# Altium project mo_phong_may_bay.PrjPcb
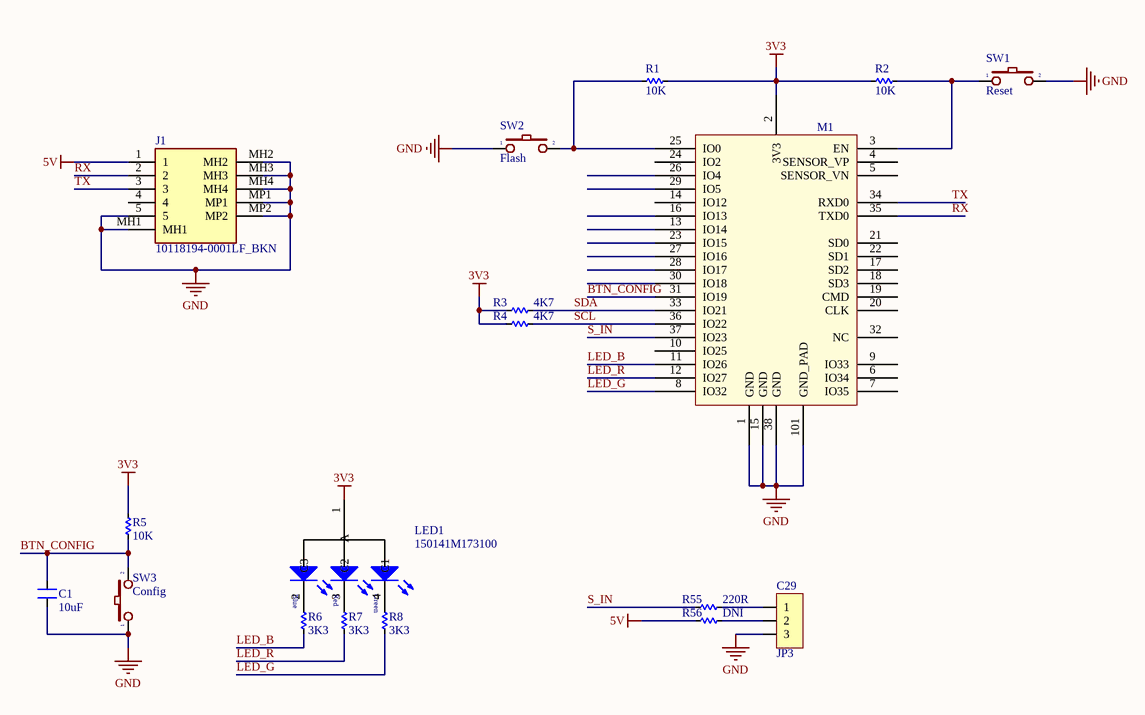
[diagram p0: [1]Esp32.SchDoc]
3 sheets, 98 parts. Net scope: global (net labels, ports and power ports of the same name join across sheets).
Board file: mo_phong_may_bay_pcb.PcbDoc
Sheets:
  [1]Esp32.SchDoc
  [2]Power.SchDoc
  [3]Motor.SchDoc

## Sheet [1]Esp32.SchDoc
size A4

### Parts
C1  10uF  [CN-SMD-0603]
C29  JP3  [JP3-D1C]
J1  10118194-0001LF_BKN  [101181940001LFBKN]
LED1  150141M173100  [LED RGB 3528]
M1  ESP32S_Module  [ESP32S]  (value not drawn)
R1  10K  [RES-SMD-0603]
R2  10K  [RES-SMD-0603]
R3  4K7  [RES-SMD-0603]
R4  4K7  [RES-SMD-0603]
R5  10K  [RES-SMD-0603]
R6  3K3  [RES-SMD-0603]
R7  3K3  [RES-SMD-0603]
R8  3K3  [RES-SMD-0603]
R55  220R  [RES-SMD-0603]
R56  DNI  [RES-SMD-0603]
SW1  Reset  [SW1-SMD]
SW2  Flash  [SW-DIP1-1]
SW3  Config  [SW1-SMD]

### Nets
3V3: LED1.1(A) M1.2(3V3) R1.1 R2.2 R3.1 R4.1 R5.2
5V: J1.1 R56.2
GND: C1.2 C29.3 J1.5 J1.MH1 J1.MH2 J1.MH3 J1.MH4 J1.MP1 J1.MP2 M1.1(GND) M1.15(GND) M1.38(GND) M1.101(GND_PAD) SW1.2 SW2.1 SW3.1
BTN_CONFIG: C1.1 M1.31(IO19) R5.1 SW3.2
LED_B: M1.11(IO26) R6.1
LED_G: M1.8(IO32) R8.1
LED_R: M1.12(IO27) R7.1
RX: J1.2 M1.35(TXD0)
S_IN: M1.37(IO23) R55.2
SCL: M1.36(IO22) R4.2
SDA: M1.33(IO21) R3.2
TX: J1.3 M1.34(RXD0)
NetC29_1: C29.1 R55.1
NetC29_2: C29.2 R56.1
NetLED1_2: LED1.2(C3) R6.2
NetLED1_3: LED1.3(C2) R7.2
NetLED1_4: LED1.4(C1) R8.2
NetM1_3: M1.3(EN) R2.1 SW1.1
NetM1_25: M1.25(IO0) R1.2 SW2.2

Not connected (* = marked no-connect by the designer): J1 4; M1 4(SENSOR_VP) 5(SENSOR_VN) 6(IO34) 7(IO35) 9(IO33) 10(IO25) 13(IO14) 14(IO12) 16(IO13) 17(SD2) 18(SD3) 19(CMD) 20(CLK) 21(SD0) 22(SD1) 23(IO15) 24(IO2) 26(IO4) 27(IO16) 28(IO17) 29(IO5) 30(IO18) 32(NC)

### Notes on the sheet
- (in symbol LED RGB SMD) Blue; Red; Green

### Library data of the parts
C1 = CN: Tu gom; Value: 33pF
C29 = JP3: WR-PHD 2.54 mm Angled Socket Header; Manufacturer: W¨¹rth Elektronik eiSos GmbH; partNo: 613003143121; ComponentLink1 Description: Manufacturer; ComponentLink2 Description: Datasheet; NoPins: 03; Created Date: 29 March 2013; ComponentLink1URL: http://www.we-online.com; ComponentLink2URL: http://katalog.we-online.de/em/datasheet/6130xx143121.pdf; Created by: Karrer Zheng
J1 = 10118194-0001LF_BKN: Connector; Manufacturer_Name: Amphenol; Manufacturer_Part_Number: 10118194-0001LF/BKN; Datasheet Link: https://cdn.amphenol-cs.com/media/wysiwyg/files/drawing/10118194.pdf; Height: 2.78mm
LED1 = LED RGB SMD: SMD Full-Color Top LED, WL-SFTW, Red & Green & Blue; Manufacturer: Würth Elektronik eiSos GmbH; PartNo: 150141M173100; ComponentLink1Description: Manufacturer; ComponentLink1URL: http://www.we-online.de; Created by: Christin Otto; Created Date: June 2013; ComponentLink2Description: Datasheet; ComponentLink2URL: http://katalog.we-online.com/led/datasheet/150141M173100.pdf; Color: Red & Green & Blue
M1 = ESP32S_Module: Esp-32S; Datasheet: https://espressif.com/sites/default/files/documentation/esp_wroom_32_datasheet_en.pdf
R1-R8 R55 R56 = Res-SMD: Resistor; Manufacturer: Generic Components; Class: Passive; Published: 08/06/2000; Publisher: Altium Hobart Technology Centre
SW1-SW3 = SW2: Switch button 2 pin; Value: SW chip 2 pin

## Sheet [2]Power.SchDoc
size A3
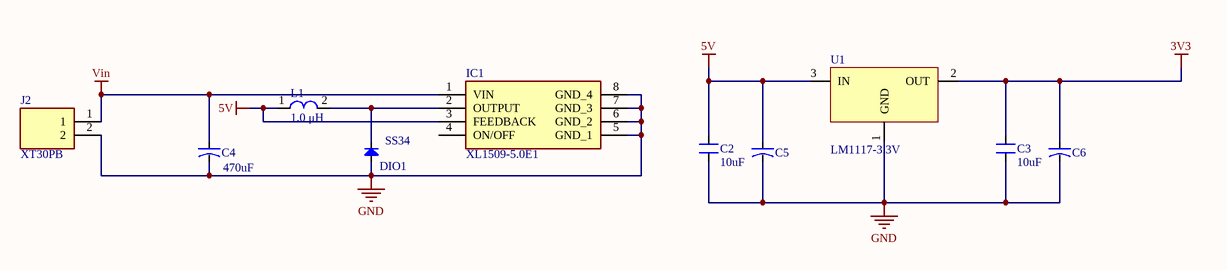
[diagram p1: [2]Power.SchDoc]

### Parts
C2  10uF  [CN-SMD-0603]
C3  10uF  [CN-SMD-0603]
C4  470uF  [CAP-ALU-SMD-6.3x7.7x2.2]
C5  CN-ALU-SMD  [CAP-ALU-SMD-4.5x5x1.4]  (value not drawn)
C6  CN-ALU-SMD  [CAP-ALU-SMD-4.5x5x1.4]  (value not drawn)
DIO1  SS34  [DIO-SMD-106]
IC1  XL1509-5.0E1  [SOIC127P600X175-8N]
J2  XT30PB  [XT30PB]
L1  1.0 μH  [L-SMD-M-7.3x4.5]
U1  LM1117-3.3V  [SOT223]

### Nets
3V3: C3.1 C6.1 U1.2(OUT)
5V: C2.1 C5.1 IC1.3(FEEDBACK) L1.1 U1.3(IN)
GND: C2.2 C3.2 C4.2 C5.2 C6.2 DIO1.1(A) IC1.5(GND_1) IC1.6(GND_2) IC1.7(GND_3) IC1.8(GND_4) J2.2 U1.1(GND)
Vin: C4.1 IC1.1(VIN) J2.1
NetDIO1_2: DIO1.2(K) IC1.2(OUTPUT) L1.2

Not connected (* = marked no-connect by the designer): IC1 4(ON/OFF)

### Library data of the parts
C2 C3 = CN: Tu gom; Value: 33pF
C4-C6 = CN-ALU-SMD: Polarized Capacitor (Axial); Published: 8-Jun-2000; LatestRevisionDate: 17-Jul-2002; LatestRevisionNote: Re-released for DXP Platform.; PackageReference: POLAR0.8; Publisher: Altium Limited
DIO1 = Diode SMD: Default Diode; Code - JEDEC: DO-214-AB; Value: 1N5007; Published: 8-Jun-2000; Revision: July-2002: Re-released for DXP Platform.; Publisher: Altium Limited
IC1 = XL1509-5.0E1: Integrated Circuit; Manufacturer_Name: XLSEMI; Datasheet Link: https://datasheet.lcsc.com/szlcsc/XLSEMI-XL1509-5-0E1_C61063.pdf; Height: 1.75mm; Manufacturer_Part_Number: XL1509-5.0E1
J2 = XT30PB: Connector; Manufacturer_Name: Amass; Datasheet Link: https://www.tme.eu/Document/4acc913878197f8c2e30d4b8cdc47230/XT30UPB%20SPEC.pdf; Height: 10.7mm; Manufacturer_Part_Number: XT30PB
L1 = L-SMD-1: partNo: 78477010; Manufacturer: Wurth Elektronik; Inductance: 1.0 μH; ComponentLink1Description: Manufacturer; ComponentLink1URL: http://www.we-online.de; Created by: Baojun Chen; Created Date: Nov.2015; ComponentLink2Description: Datasheet; ComponentLink2URL: http://katalog.we-online.de/pbs/datasheet/78477010.pdf
U1 = LM1117: 800mA Low-Dropout Linear Regulator; Creator: Nguyen Ba Bien; Website: http://group3i.net

## Sheet [3]Motor.SchDoc
size A3
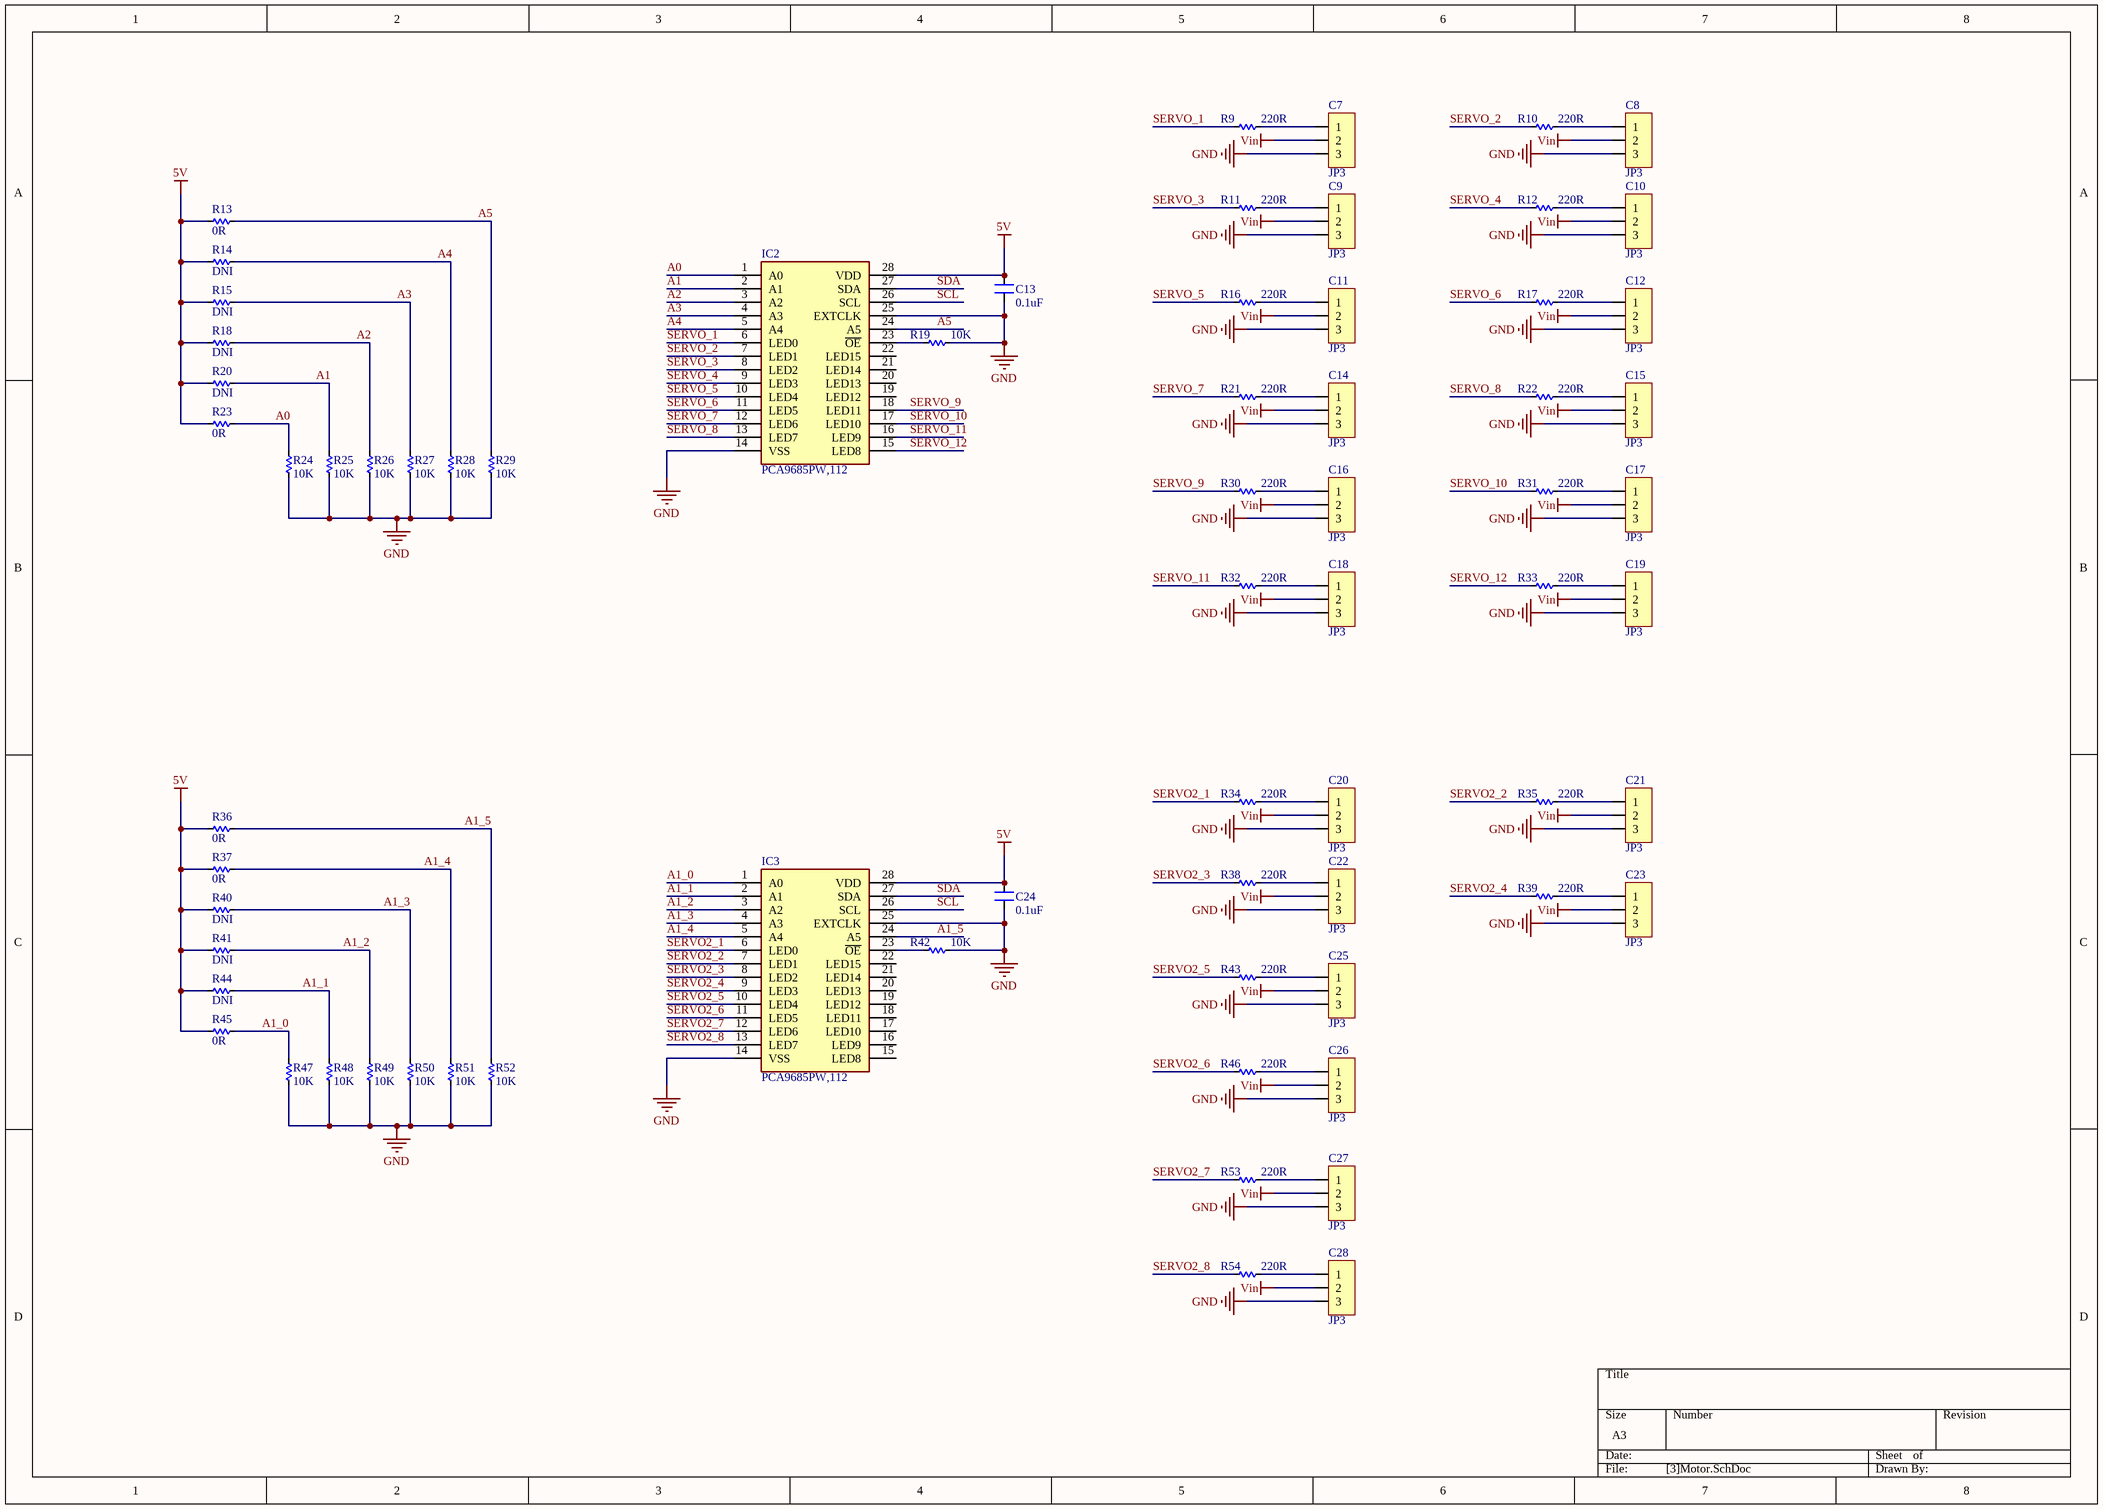
[diagram p2: [3]Motor.SchDoc]

### Parts
C7  JP3  [JP3-D1T]
C8  JP3  [JP3-D1T]
C9  JP3  [JP3-D1T]
C10  JP3  [JP3-D1T]
C11  JP3  [JP3-D1T]
C12  JP3  [JP3-D1T]
C13  0.1uF  [CN-SMD-0603]
C14  JP3  [JP3-D1T]
C15  JP3  [JP3-D1T]
C16  JP3  [JP3-D1T]
C17  JP3  [JP3-D1T]
C18  JP3  [JP3-D1T]
C19  JP3  [JP3-D1T]
C20  JP3  [JP3-D1T]
C21  JP3  [JP3-D1T]
C22  JP3  [JP3-D1T]
C23  JP3  [JP3-D1T]
C24  0.1uF  [CN-SMD-0603]
C25  JP3  [JP3-D1T]
C26  JP3  [JP3-D1T]
C27  JP3  [JP3-D1T]
C28  JP3  [JP3-D1T]
IC2  PCA9685PW,112  [SOP65P640X110-28N]
IC3  PCA9685PW,112  [SOP65P640X110-28N]
R9  220R  [RES-SMD-0603]
R10  220R  [RES-SMD-0603]
R11  220R  [RES-SMD-0603]
R12  220R  [RES-SMD-0603]
R13  0R  [RES-SMD-0603]
R14  DNI  [RES-SMD-0603]
R15  DNI  [RES-SMD-0603]
R16  220R  [RES-SMD-0603]
R17  220R  [RES-SMD-0603]
R18  DNI  [RES-SMD-0603]
R19  10K  [RES-SMD-0603]
R20  DNI  [RES-SMD-0603]
R21  220R  [RES-SMD-0603]
R22  220R  [RES-SMD-0603]
R23  0R  [RES-SMD-0603]
R24  10K  [RES-SMD-0603]
R25  10K  [RES-SMD-0603]
R26  10K  [RES-SMD-0603]
R27  10K  [RES-SMD-0603]
R28  10K  [RES-SMD-0603]
R29  10K  [RES-SMD-0603]
R30  220R  [RES-SMD-0603]
R31  220R  [RES-SMD-0603]
R32  220R  [RES-SMD-0603]
R33  220R  [RES-SMD-0603]
R34  220R  [RES-SMD-0603]
R35  220R  [RES-SMD-0603]
R36  0R  [RES-SMD-0603]
R37  0R  [RES-SMD-0603]
R38  220R  [RES-SMD-0603]
R39  220R  [RES-SMD-0603]
R40  DNI  [RES-SMD-0603]
R41  DNI  [RES-SMD-0603]
R42  10K  [RES-SMD-0603]
R43  220R  [RES-SMD-0603]
R44  DNI  [RES-SMD-0603]
R45  0R  [RES-SMD-0603]
R46  220R  [RES-SMD-0603]
R47  10K  [RES-SMD-0603]
R48  10K  [RES-SMD-0603]
R49  10K  [RES-SMD-0603]
R50  10K  [RES-SMD-0603]
R51  10K  [RES-SMD-0603]
R52  10K  [RES-SMD-0603]
R53  220R  [RES-SMD-0603]
R54  220R  [RES-SMD-0603]

### Nets
5V: C13.2 C24.2 IC2.28(VDD) IC3.28(VDD) R13.2 R14.2 R15.2 R18.2 R20.2 R23.2 R36.2 R37.2 R40.2 R41.2 R44.2 R45.2
GND: C7.3 C8.3 C9.3 C10.3 C11.3 C12.3 C13.1 C14.3 C15.3 C16.3 C17.3 C18.3 C19.3 C20.3 C21.3 C22.3 C23.3 C24.1 C25.3 C26.3 C27.3 C28.3 IC2.14(VSS) IC2.25(EXTCLK) IC3.14(VSS) IC3.25(EXTCLK) R19.2 R24.2 R25.2 R26.2 R27.2 R28.2 R29.2 R42.2 R47.2 R48.2 R49.2 R50.2 R51.2 R52.2
Vin: C7.2 C8.2 C9.2 C10.2 C11.2 C12.2 C14.2 C15.2 C16.2 C17.2 C18.2 C19.2 C20.2 C21.2 C22.2 C23.2 C25.2 C26.2 C27.2 C28.2
A0: IC2.1(A0) R23.1 R24.1
A1: IC2.2(A1) R20.1 R25.1
A1_0: IC3.1(A0) R45.1 R47.1
A1_1: IC3.2(A1) R44.1 R48.1
A1_2: IC3.3(A2) R41.1 R49.1
A1_3: IC3.4(A3) R40.1 R50.1
A1_4: IC3.5(A4) R37.1 R51.1
A1_5: IC3.24(A5) R36.1 R52.1
A2: IC2.3(A2) R18.1 R26.1
A3: IC2.4(A3) R15.1 R27.1
A4: IC2.5(A4) R14.1 R28.1
A5: IC2.24(A5) R13.1 R29.1
SCL: IC2.26(SCL) IC3.26(SCL)
SDA: IC2.27(SDA) IC3.27(SDA)
SERVO2_1: IC3.6(LED0) R34.1
SERVO2_2: IC3.7(LED1) R35.1
SERVO2_3: IC3.8(LED2) R38.1
SERVO2_4: IC3.9(LED3) R39.1
SERVO2_5: IC3.10(LED4) R43.1
SERVO2_6: IC3.11(LED5) R46.1
SERVO2_7: IC3.12(LED6) R53.1
SERVO2_8: IC3.13(LED7) R54.1
SERVO_1: IC2.6(LED0) R9.1
SERVO_2: IC2.7(LED1) R10.1
SERVO_3: IC2.8(LED2) R11.1
SERVO_4: IC2.9(LED3) R12.1
SERVO_5: IC2.10(LED4) R16.1
SERVO_6: IC2.11(LED5) R17.1
SERVO_7: IC2.12(LED6) R21.1
SERVO_8: IC2.13(LED7) R22.1
SERVO_9: IC2.18(LED11) R30.1
SERVO_10: IC2.17(LED10) R31.1
SERVO_11: IC2.16(LED9) R32.1
SERVO_12: IC2.15(LED8) R33.1
NetC7_1: C7.1 R9.2
NetC8_1: C8.1 R10.2
NetC9_1: C9.1 R11.2
NetC10_1: C10.1 R12.2
NetC11_1: C11.1 R16.2
NetC12_1: C12.1 R17.2
NetC14_1: C14.1 R21.2
NetC15_1: C15.1 R22.2
NetC16_1: C16.1 R30.2
NetC17_1: C17.1 R31.2
NetC18_1: C18.1 R32.2
NetC19_1: C19.1 R33.2
NetC20_1: C20.1 R34.2
NetC21_1: C21.1 R35.2
NetC22_1: C22.1 R38.2
NetC23_1: C23.1 R39.2
NetC25_1: C25.1 R43.2
NetC26_1: C26.1 R46.2
NetC27_1: C27.1 R53.2
NetC28_1: C28.1 R54.2
NetIC2_23: IC2.23(~{OE}) R19.1
NetIC3_23: IC3.23(~{OE}) R42.1

Not connected (* = marked no-connect by the designer): IC2 19(LED12) 20(LED13) 21(LED14) 22(LED15); IC3 15(LED8) 16(LED9) 17(LED10) 18(LED11) 19(LED12) 20(LED13) 21(LED14) 22(LED15)

### Library data of the parts
C7-C12 C14-C23 C25-C28 = JP3: as C29 on sheet [1]Esp32; Created Date: 29 March 2013; ComponentLink1URL: http://www.we-online.com; ComponentLink2URL: http://katalog.we-online.de/em/datasheet/6130xx143121.pdf; Created by: Karrer Zheng
C13 C24 = CN: Tu gom; Value: 33pF
IC2 IC3 = PCA9685PW,112: Integrated Circuit; Manufacturer_Name: NXP; Datasheet Link: http://www.nxp.com/docs/en/data-sheet/PCA9685.pdf; Height: 1.1mm; Manufacturer_Part_Number: PCA9685PW,112; Mouser Part Number: 771-PCA9685PW,112; Mouser Price/Stock: https://www.mouser.co.uk/ProductDetail/NXP-Semiconductors/PCA9685PW112?qs=6YAT8rHPFU9wZqiAeiOMZw%3D%3D; Arrow Part Number: PCA9685PW,112; Arrow Price/Stock: https://www.arrow.com/en/products/pca9685pw112/nxp-semiconductors?region=nac
R9-R54 = Res-SMD: as R1 on sheet [1]Esp32; Published: 08/06/2000; Publisher: Altium Hobart Technology Centre

## Nets that join several sheets
3V3: [1]Esp32 (7 pins), [2]Power (C3.1 C6.1 U1.2)
5V: [1]Esp32 (J1.1 R56.2), [2]Power (5 pins), [3]Motor (16 pins)
GND: [1]Esp32 (16 pins), [2]Power (12 pins), [3]Motor (40 pins)
Vin: [2]Power (C4.1 IC1.1 J2.1), [3]Motor (20 pins)
SCL: [1]Esp32 (M1.36 R4.2), [3]Motor (IC2.26 IC3.26)
SDA: [1]Esp32 (M1.33 R3.2), [3]Motor (IC2.27 IC3.27)